# EAGLE design Placa ATMEL 2019 v2.4 (EAGLE 7.6.0)
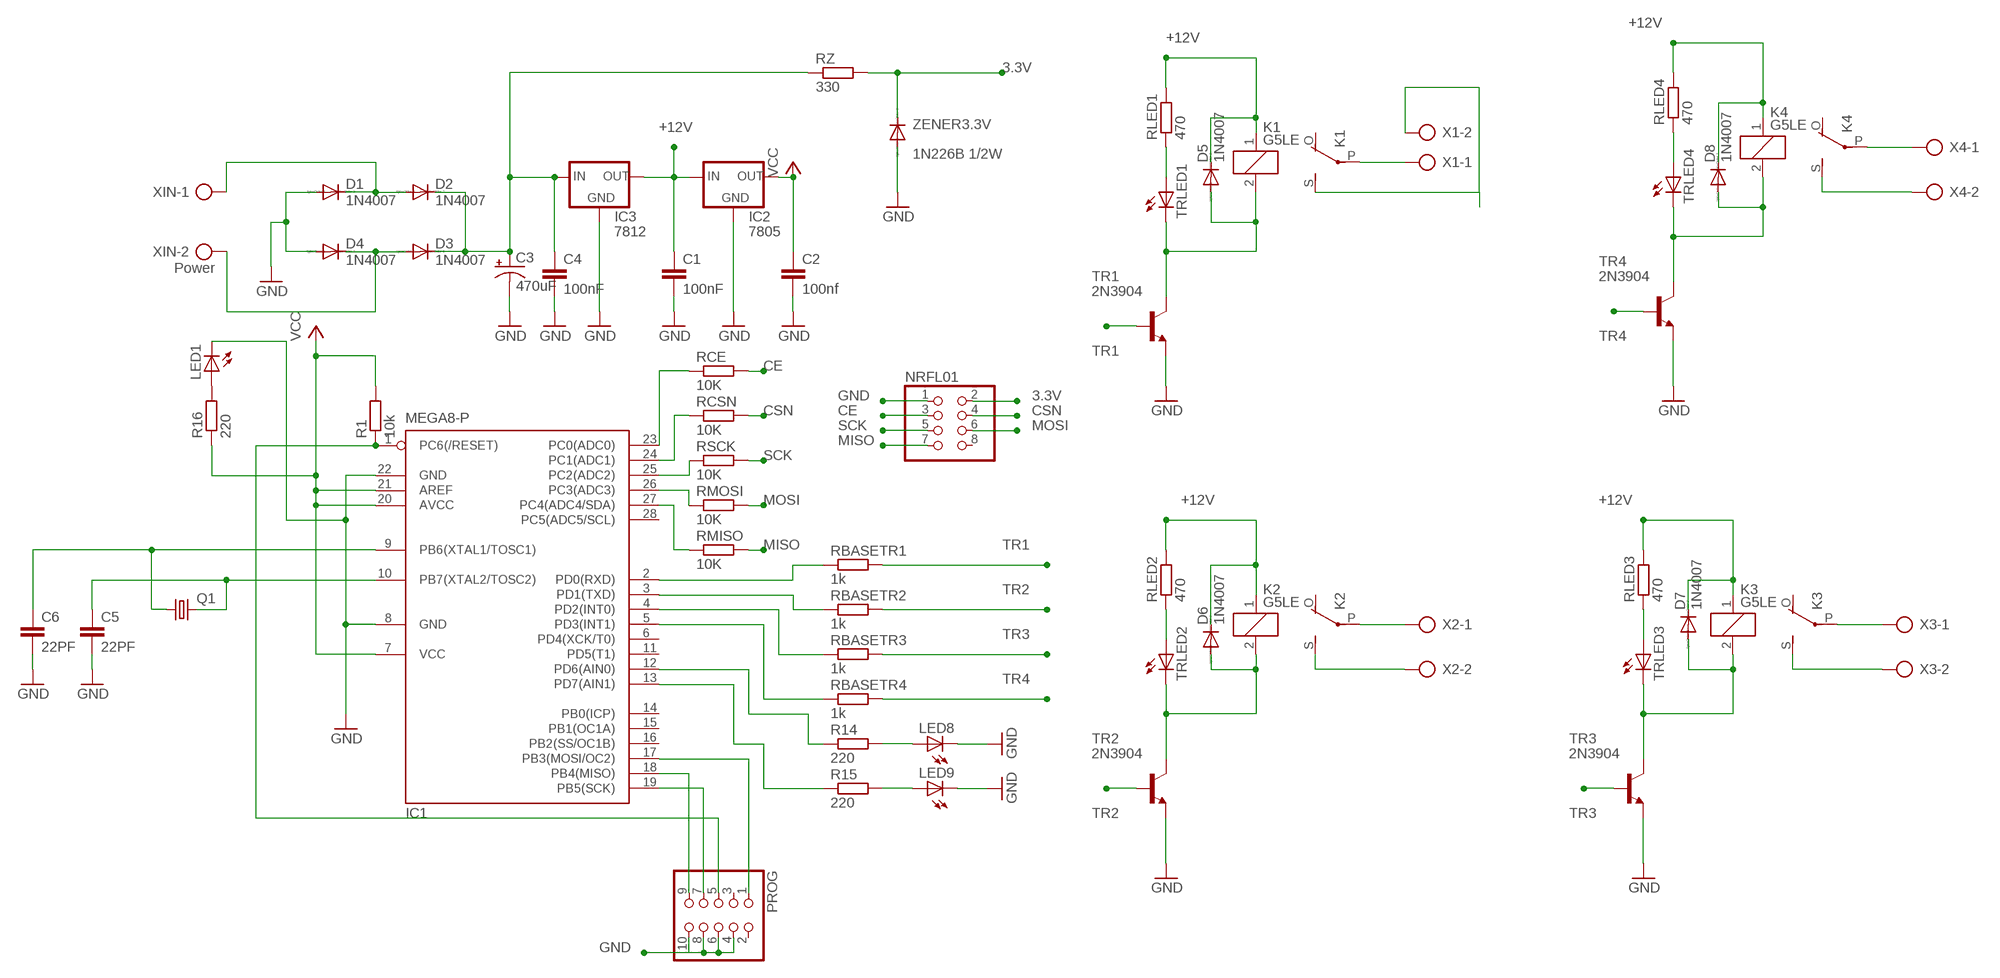
[diagram p0: schematic, sheet 1]

## Parts
C1  100nF  C-EU050-025X075  [C050-025X075]
C2  100nf  C-EU050-025X075  [C050-025X075]
C3  470uF  CPOL-USE7.5-16  [E7,5-16]
C4  100nF  C-EU050-025X075  [C050-025X075]
C5  22PF  C-EU050-024X044  [C050-024X044]
C6  22PF  C-EU050-024X044  [C050-024X044]
D1  1N4007  1N4004  [DO41-10]
D2  1N4007  1N4004  [DO41-10]
D3  1N4007  1N4004  [DO41-10]
D4  1N4007  1N4004  [DO41-10]
D5  1N4007  1N4004  [DO41-10]
D6  1N4007  1N4004  [DO41-10]
D7  1N4007  1N4004  [DO41-10]
D8  1N4007  1N4004  [DO41-10]
IC1  MEGA8-P  [DIL28-3]
IC2  7805  78XXL  [78XXL]
IC3  7812  78XXL  [78XXL]
K1  G5LE  [G5LE]
K2  G5LE  [G5LE]
K3  G5LE  [G5LE]
K4  G5LE  [G5LE]
LED1  LED5MM  [LED5MM]
LED8  LED5MM  [LED5MM]
LED9  LED5MM  [LED5MM]
NRFL01  PINHD-2X4  [2X04]
PROG  PINHD-2X5  [2X05]
Q1  CRYSTALHC49S  [HC49/S]
R1  10k  R-EU_0207/10  [0207/10]
R14  220  R-EU_0207/10  [0207/10]
R15  220  R-EU_0207/10  [0207/10]
R16  220  R-EU_0309/10  [0309/10]
RBASETR1  1k  R-EU_0207/10  [0207/10]
RBASETR2  1k  R-EU_0207/10  [0207/10]
RBASETR3  1k  R-EU_0204/7  [0204/7]
RBASETR4  1k  R-EU_0207/15  [0207/15]
RCE  10K  R-EU_0207/10  [0207/10]
RCSN  10K  R-EU_0207/10  [0207/10]
RLED1  470  R-EU_0207/10  [0207/10]
RLED2  470  R-EU_0207/10  [0207/10]
RLED3  470  R-EU_0207/10  [0207/10]
RLED4  470  R-EU_0207/10  [0207/10]
RMISO  10K  R-EU_0207/10  [0207/10]
RMOSI  10K  R-EU_0207/10  [0207/10]
RSCK  10K  R-EU_0207/10  [0207/10]
RZ  330  R-EU_0207/10  [0207/10]
TR1  2N3904  [TO92]
TR2  2N3904  [TO92]
TR3  2N3904  [TO92]
TR4  2N3904  [TO92]
TRLED1  LED5MM  [LED5MM]
TRLED2  LED5MM  [LED5MM]
TRLED3  LED5MM  [LED5MM]
TRLED4  LED5MM  [LED5MM]
X1  AK300/2  [AK300/2]
X2  AK300/2  [AK300/2]
X3  AK300/2  [AK300/2]
X4  AK300/2  [AK300/2]
XIN  Power  AK500/2  [AK500/2]
ZENER3.3V  1N226B 1/2W  1N4148DO35-10  [DO35-10]

## Nets
3.3V: NRFL01.2 RZ.2 ZENER3.3V.C
+12V: C1.1 D5.C D6.C D7.C D8.C IC2.IN IC3.OUT K1.1 K2.1 K3.1 K4.1 RLED1.2 RLED2.2 RLED3.2 RLED4.2
CE: NRFL01.3 RCE.2
CSN: NRFL01.4 RCSN.2
GND: C1.2 C2.2 C3.- C4.2 C5.2 C6.2 D1.A D4.A IC1.8(GND) IC1.22(GND) IC2.GND IC3.GND LED1.K(C) LED8.K(C) LED9.K(C) NRFL01.1 PROG.4 PROG.6 PROG.8 PROG.10 TR1.3(E) TR2.3(E) TR3.3(E) TR4.3(E) ZENER3.3V.A
MISO: NRFL01.7 RMISO.2
MOSI: NRFL01.6 RMOSI.2
N$1: IC1.1(PC6(/RESET)) PROG.5 R1.1
N$2: IC1.23(PC0(ADC0)) RCE.1
N$3: IC1.24(PC1(ADC1)) RCSN.1
N$4: IC1.25(PC2(ADC2)) RSCK.1
N$5: IC1.26(PC3(ADC3)) RMOSI.1
N$6: RLED1.1 TRLED1.A
N$7: IC1.2(PD0(RXD)) RBASETR1.1
N$8: IC1.3(PD1(TXD)) RBASETR2.1
N$10: IC1.4(PD2(INT0)) RBASETR3.1
N$12: IC1.5(PD3(INT1)) RBASETR4.1
N$13: IC1.12(PD6(AIN0)) R14.1
N$14: IC1.13(PD7(AIN1)) R15.1
N$15: IC1.27(PC4(ADC4/SDA)) RMISO.1
N$16: IC1.17(PB3(MOSI/OC2)) PROG.1
N$17: LED1.A R16.2
N$18: IC1.19(PB5(SCK)) PROG.7
N$19: IC1.18(PB4(MISO)) PROG.9
N$22: C3.+ C4.1 D2.C D3.C IC3.IN RZ.1
N$24: D1.C D2.A XIN.1
N$29: D5.A K1.2 TR1.1(C) TRLED1.K(C)
N$31: K1.S(2:S) X1.2
N$32: K1.P(2:P) X1.1
N$65: D3.A D4.C XIN.2
N$71: RLED2.1 TRLED2.A
N$81: D6.A K2.2 TR2.1(C) TRLED2.K(C)
N$83: K2.S(2:S) X2.2
N$84: K2.P(2:P) X2.1
N$85: RLED3.1 TRLED3.A
N$86: D7.A K3.2 TR3.1(C) TRLED3.K(C)
N$88: K3.S(2:S) X3.2
N$89: K3.P(2:P) X3.1
N$118: RLED4.1 TRLED4.A
N$135: C5.1 IC1.10(PB7(XTAL2/TOSC2)) Q1.2
N$136: C6.1 IC1.9(PB6(XTAL1/TOSC1)) Q1.1
N$138: D8.A K4.2 TR4.1(C) TRLED4.K(C)
N$147: K4.S(2:S) X4.2
N$148: K4.P(2:P) X4.1
N$152: LED8.A R14.2
N$153: LED9.A R15.2
SCK: NRFL01.5 RSCK.2
TR1: RBASETR1.2 TR1.2(B)
TR2: RBASETR2.2 TR2.2(B)
TR3: RBASETR3.2 TR3.2(B)
TR4: RBASETR4.2 TR4.2(B)
VCC: C2.1 IC1.7(VCC) IC1.20(AVCC) IC1.21(AREF) IC2.OUT R1.2 R16.1
Unconnected: IC1.6(PD4(XCK/T0)) IC1.11(PD5(T1)) IC1.14(PB0(ICP)) IC1.15(PB1(OC1A)) IC1.16(PB2(SS/OC1B)) IC1.28(PC5(ADC5/SCL)) K1.O(2:O) K2.O(2:O) K3.O(2:O) K4.O(2:O) NRFL01.8 PROG.2 PROG.3

## Library data of the parts
C1 C2 C4-C6 = rcl:C-EU: CAPACITOR, European symbol
C3 = rcl:CPOL-US: POLARIZED CAPACITOR, American symbol
D1-D8 = diode:1N4004: DIODE general purpose rectifier, 1 A
IC1 = atmel:MEGA8-P: MICROCONTROLLER 8 Kbytes FLASH, 1 kbytes SRAM, 512 bytes EEPROM, USART, 4-channel 10 bit ADC, 2-channel 8 bit ADC Pin compatible with Atmega48, ATMega88, ATMega168 Source: avr.lbr; OC_FARNELL: unknown; OC_NEWARK: unknown
IC2 IC3 = v-reg:78XXL: VOLTAGE REGULATOR
K1-K4 = relay:G5LE: RELAY 1 x switch, 10 A/120 V AC, 8 A/30 V DC, Omron; OC_FARNELL: unknown; OC_NEWARK: unknown
LED1 LED8 LED9 TRLED1-TRLED4 = led:LED: LED OSRAM: - CHIPLED LG R971, LG N971, LY N971, LG Q971, LY Q971, LO R971, LY R971 LH N974, LH R974 LS Q976, LO Q976, LY Q976 LO Q996 - Hyper CHIPLED LW Q18S LB Q993, LB Q99A, LB R99A - SideLED LS A670, LO A670, LY A670, LG A670, LP A670 LB A673, LV A673, LT A673, LW A673 LH A674 LY A675 LS A676, LA A676, LO A676, LY A676, LW A676 LS A679, LY A679, LG A679 - Hyper Micro SIDELED® LS Y876, LA Y876, LO Y876, LY Y876 LT Y87S - SmartLED LW L88C, LW L88S LB L89C, LB L89S, LG L890 LS L89K, LO L89K, LY L89K LS L896, LA L896, LO L896, LY L896 - TOPLED LS T670, LO T670, LY T670, LG T670, LP T670 LSG T670, LSP T670, LSY T670, LOP T670, LYG T670 LG T671, LOG T671, LSG T671 LB T673, LV T673, LT T673, LW T673 LH T674 LS T676, LA T676, LO T676, LY T676, LB T676, LH T676, LSB T676, LW T676 LB T67C, LV T67C, LT T67C, LS T67K, LO T67K, LY T67K, LW E67C LS E67B, LA E67B, LO E67B, LY E67B, LB E67C, LV E67C, LT E67C LW T67C LS T679, LY T679, LG T679 LS T770, LO T770, LY T770, LG T770, LP T770 LB T773, LV T773, LT T773, LW T773 LH T774 LS E675, LA E675, LY E675, LS T675 LS T776, LA T776, LO T776, LY T776, LB T776 LHGB T686 LT T68C, LB T68C - Hyper Mini TOPLED® LB M676 - Mini TOPLED Santana® LG M470 LS M47K, LO M47K, LY M47K Source: http://www.osram.convergy.de LUXEON: - LUMILED® LXK2-PW12-R00, LXK2-PW12-S00, LXK2-PW14-U00, LXK2-PW14-V00 LXK2-PM12-R00, LXK2-PM12-S00, LXK2-PM14-U00 LXK2-PE12-Q00, LXK2-PE12-R00, LXK2-PE12-S00, LXK2-PE14-T00, LXK2-PE14-U00 LXK2-PB12-K00, LXK2-PB12-L00, LXK2-PB12-M00, LXK2-PB14-N00, LXK2-PB14-P00, LXK2-PB14-Q00 LXK2-PR12-L00, LXK2-PR12-M00, LXK2-PR14-Q00, LXK2-PR14-R00 LXK2-PD12-Q00, LXK2-PD12-R00, LXK2-PD12-S00 LXK2-PH12-R00, LXK2-PH12-S00 LXK2-PL12-P00, LXK2-PL12-Q00, LXK2-PL12-R00 Source: www.luxeon.com KINGBRIGHT: KA-3528ASYC Source: www.kingbright.com
NRFL01 = pinhead:PINHD-2X4: PIN HEADER
PROG = pinhead:PINHD-2X5: PIN HEADER
Q1 = crystal:CRYSTAL: CRYSTAL; OC_FARNELL: 1667008; OC_NEWARK: unknown
R1 R14-R16 RBASETR1-RBASETR4 RCE RCSN RLED1-RLED4 RMISO RMOSI RSCK RZ = rcl:R-EU_: RESISTOR, European symbol
TR1-TR4 = transistor-npn:2N3904: NPN Transistor
X1-X4 = con-ptr500:AK300/2: CONNECTOR; OC_FARNELL: unknown; OC_NEWARK: unknown
XIN = con-ptr500:AK500/2: CONNECTOR; OC_FARNELL: unknown; OC_NEWARK: unknown
ZENER3.3V = diode:1N4148: DIODE high speed (Philips)

## Board
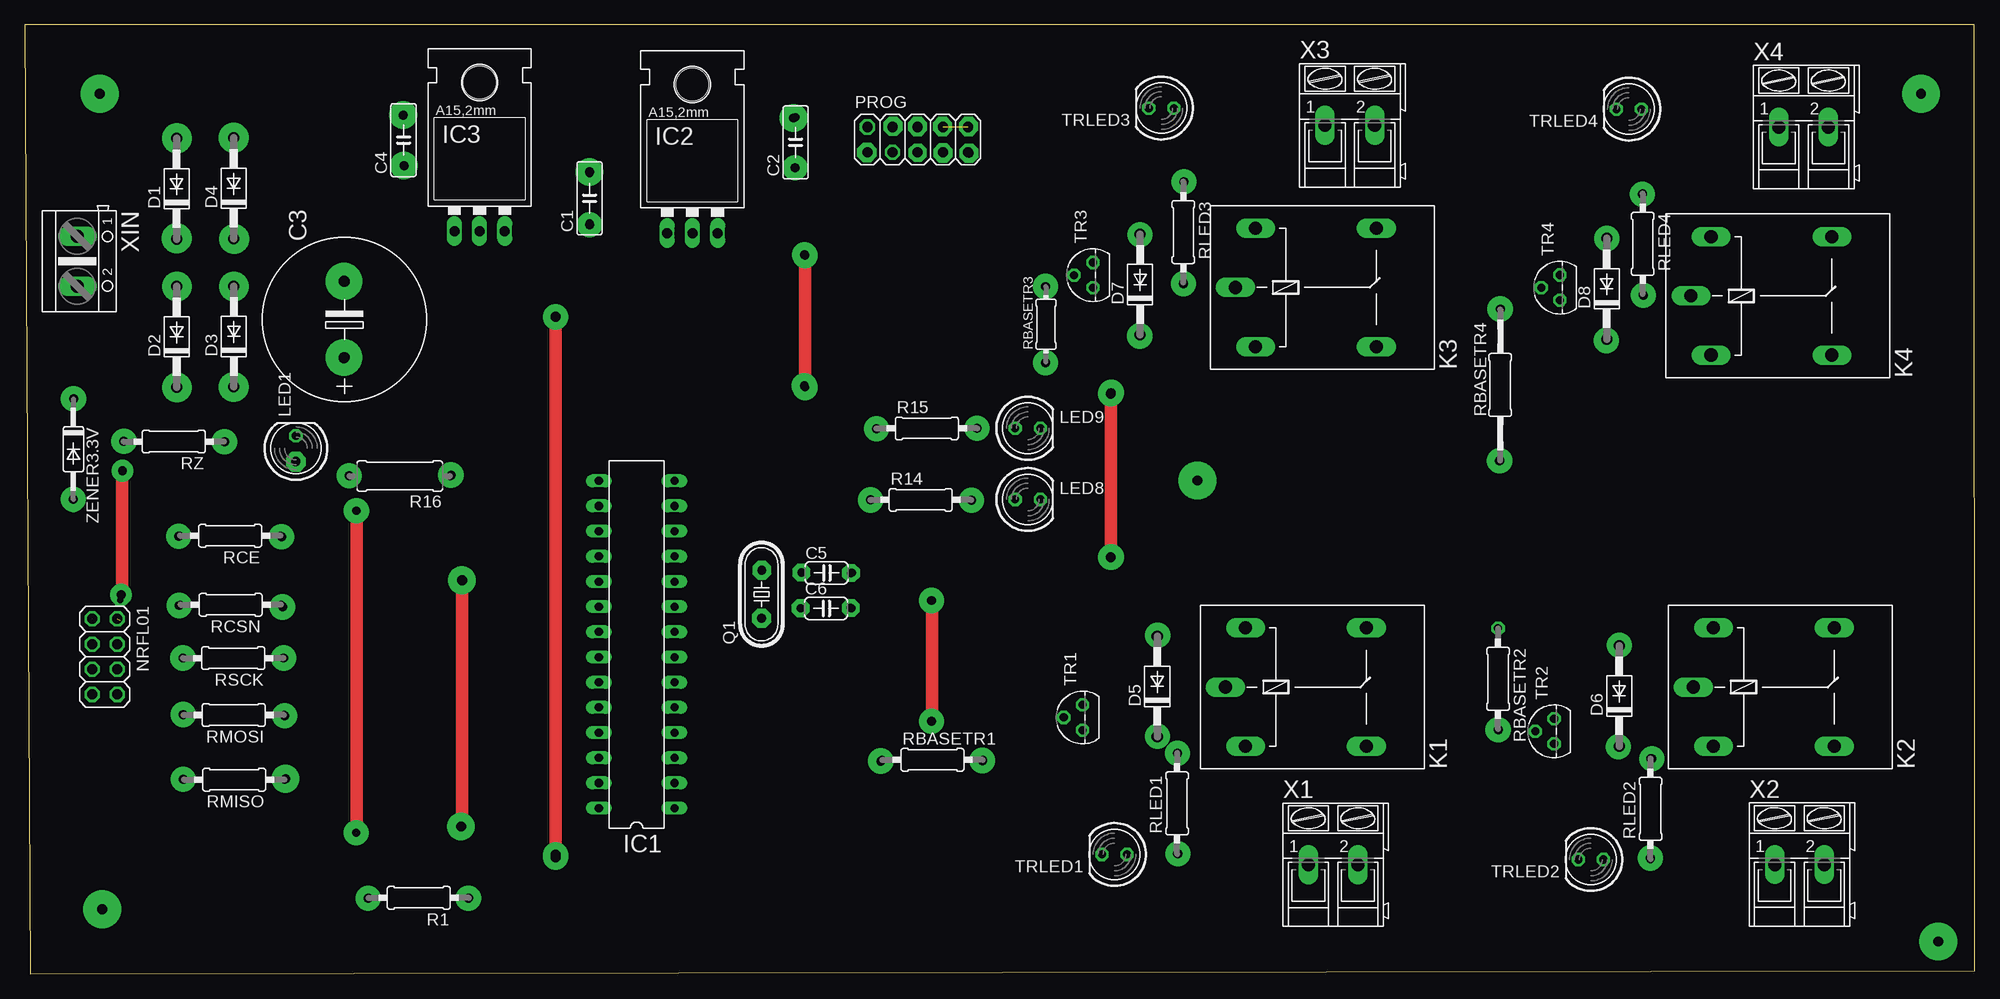
[diagram p1: board, top side]
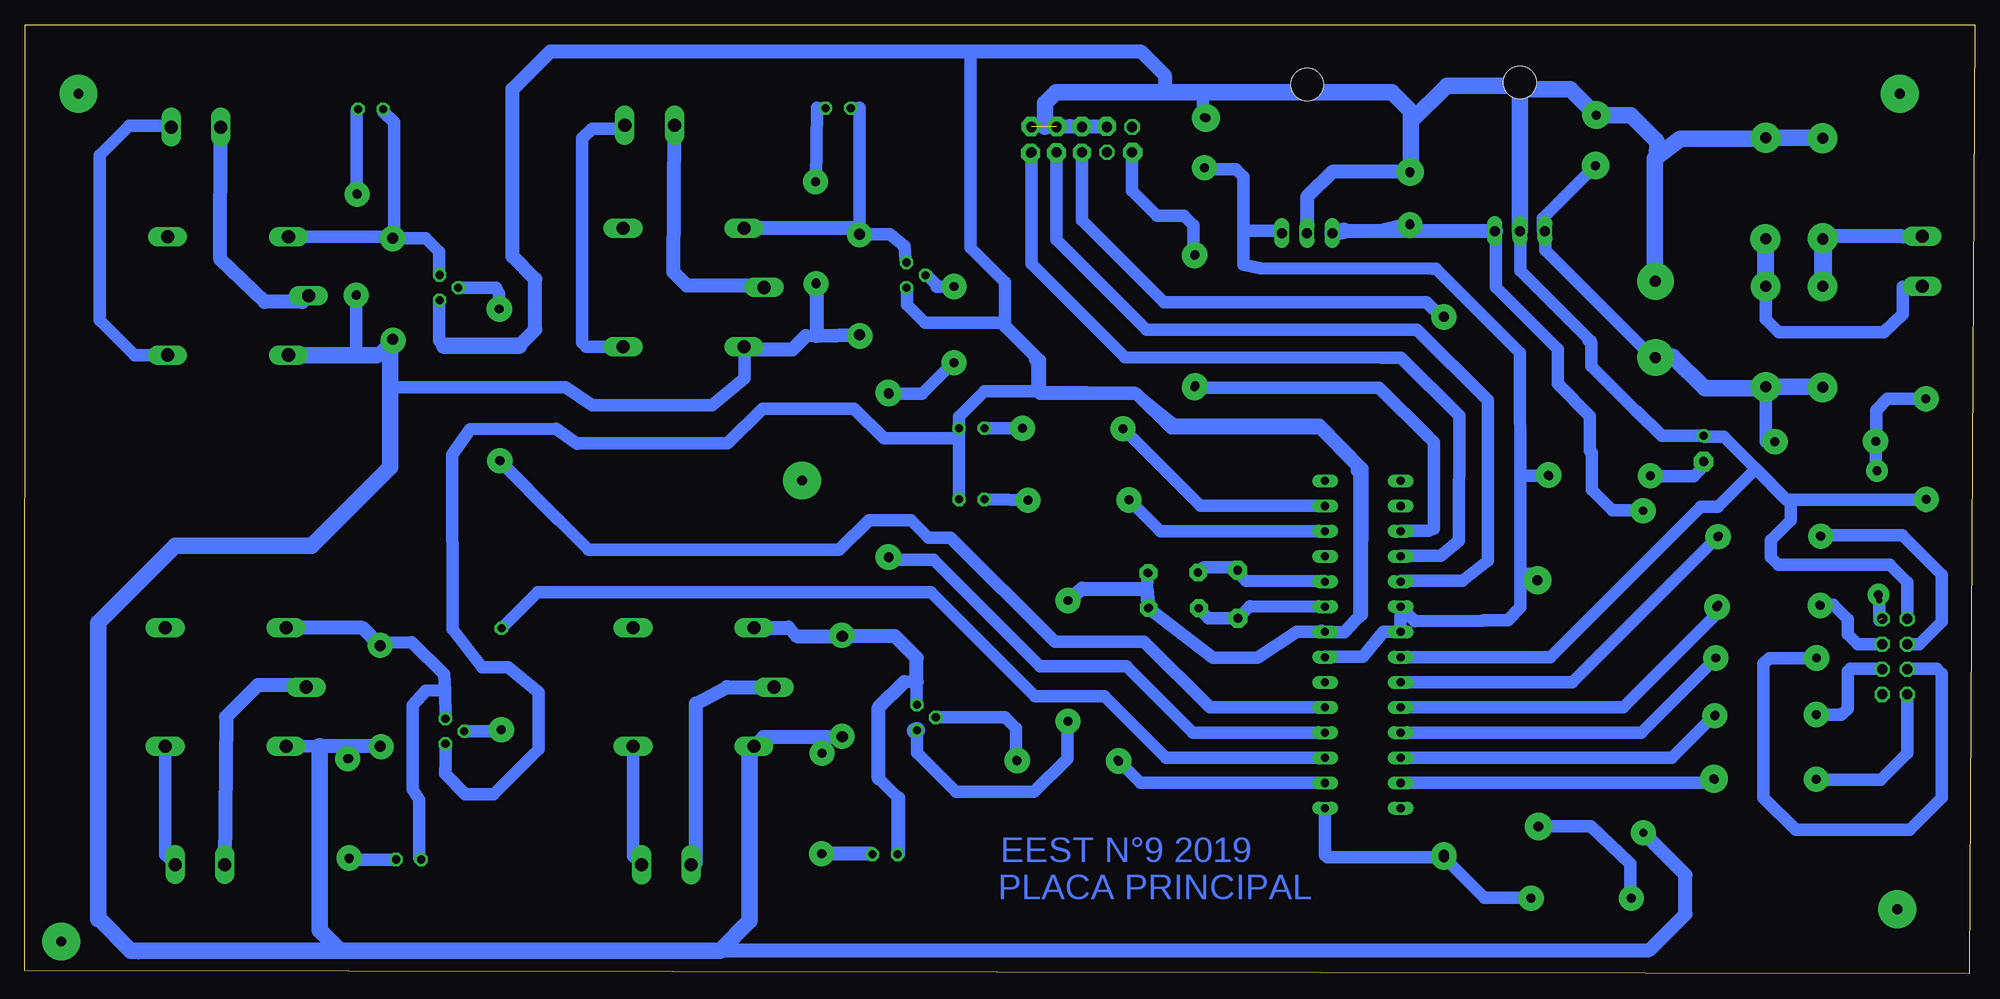
[diagram p2: board, bottom side, seen from below]

Size 196.74 x 95.72 mm. Coordinates in mm from the lower left corner, seen from the top.
Outline: 0.57,0 196.74,0.28 196.7,95.72 0,95.7 0.57,0
Copper layers (1*16): Top 0.035mm / dielectric 1.5mm / Bottom 0.035mm
Design rules "default *": minimum track width 10mil, minimum drill 1mm, track to track 1mm, track to pad 1mm, pad to pad 1mm, via to via 1mm, smd to smd 1mm, copper to edge 1mm, drill to drill 1mm, minimum pad ring 10mil, minimum via ring 8mil, stop-mask expansion 4mil, vias tented up to drill 0mil, thermal gap 10mil

### Footprints (pad centres in the part's own frame; a part is rotated, then mirrored left to right if it is on the bottom)
C050-025X075 = drill 0.813 octagon: 1 -2.54,0; 2 2.54,0
E7,5-16 = drill 1.016 pad 3.15: + -3.81,0 | drill 1.016 pad 3.15 octagon: - 3.81,0
C050-024X044 = drill 0.813 octagon: 1 -2.54,0; 2 2.54,0
DO41-10 = drill 1.118: A 5.08,0; C -5.08,0
DIL28-3 = drill 0.813 long: 1 -16.51,-3.81; 2 -13.97,-3.81; 3 -11.43,-3.81; 4 -8.89,-3.81; 5 -6.35,-3.81; 6 -3.81,-3.81; 7 -1.27,-3.81; 8 1.27,-3.81; 9 3.81,-3.81; 10 6.35,-3.81; 11 8.89,-3.81; 12 11.43,-3.81; 13 13.97,-3.81; 14 16.51,-3.81; 15 16.51,3.81; 16 13.97,3.81; 17 11.43,3.81; 18 8.89,3.81; 19 6.35,3.81; 20 3.81,3.81; 21 1.27,3.81; 22 -1.27,3.81; 23 -3.81,3.81; 24 -6.35,3.81; 25 -8.89,3.81; 26 -11.43,3.81; 27 -13.97,3.81; 28 -16.51,3.81
78XXL = drill 1.016 long: GND 0,-3.81; IN -2.54,-3.81; OUT 2.54,-3.81 | hole 3.302: 0,11.176
G5LE = drill 1.321 long: 1 -7.493,-5.969; 2 -7.493,5.969; O 4.699,5.969; P -9.525,0; S 4.699,-5.969
LED5MM = drill 0.813 octagon: A -1.27,0; K 1.27,0
2X04 = drill 1.016 octagon: 1 -3.81,-1.27; 2 -3.81,1.27; 3 -1.27,-1.27; 4 -1.27,1.27; 5 1.27,-1.27; 6 1.27,1.27; 7 3.81,-1.27; 8 3.81,1.27
2X05 = drill 1.016 octagon: 1 -5.08,-1.27; 2 -5.08,1.27; 3 -2.54,-1.27; 4 -2.54,1.27; 5 0,-1.27; 6 0,1.27; 7 2.54,-1.27; 8 2.54,1.27; 9 5.08,-1.27; 10 5.08,1.27
HC49/S = drill 0.813: 1 -2.413,0; 2 2.413,0
0207/10 = drill 0.813 octagon: 1 -5.08,0; 2 5.08,0
0309/10 = drill 0.813 octagon: 1 -5.08,0; 2 5.08,0
0204/7 = drill 0.813 octagon: 1 -3.81,0; 2 3.81,0
0207/15 = drill 0.813 octagon: 1 -7.62,0; 2 7.62,0
TO92 = drill 0.813 octagon: 1 1.27,0; 2 0,1.905; 3 -1.27,0
AK300/2 = drill 1.321 long: 1 -2.515,0; 2 2.489,0
AK500/2 = drill 1.321 long: 1 -2.515,0; 2 2.515,0
DO35-10 = drill 0.813 long: A 5.08,0; C -5.08,0

### Placement (x,y rotation side)
C1  56.98,78.22 90 top
C2  77.78,83.85 90 top
C3  32.25,66 90 top
C4  38.21,84.09 90 top
C5  80.9,40.43 0 top
C6  80.85,36.85 0 top
D1  15.32,79.19 90 top
D2  15.33,64.25 90 top
D3  21.09,64.28 90 top
D4  21.08,79.23 90 top
D5  114.26,28.98 90 top
D6  160.87,28.02 90 top
D7  112.53,69.52 90 top
D8  159.61,69.1 90 top
IC1  61.73,33.21 90 top
IC2  67.36,78.52 0 top
IC3  45.89,78.71 0 top
K1  130.67,28.92 0 top
K2  177.87,28.92 0 top
K3  131.67,69.22 0 top
K4  177.63,68.38 0 top
LED1  27.36,52.99 90 top
LED8  101.2,47.84 0 top
LED9  101.2,55.02 0 top
NRFL01  8.07,31.98 270 top
PROG  90.09,84.14 0 top
Q1  74.33,38.28 90 top
R1  39.75,7.66 180 top
R14  90.39,47.8 0 top
R15  91.01,55.01 0 top
R16  37.83,50.2 180 top
RBASETR1  91.58,21.58 0 top
RBASETR2  148.65,29.75 270 top
RBASETR3  103.03,65.51 90 top
RBASETR4  148.86,59.39 90 top
RCE  20.72,44.18 180 top
RCSN  20.77,37.22 180 top
RLED1  116.26,17.18 90 top
RLED2  164.03,16.63 90 top
RLED3  116.89,74.81 270 top
RLED4  163.24,73.62 270 top
RMISO  21.13,19.57 180 top
RMOSI  21.08,26.1 180 top
RSCK  21.03,31.84 180 top
RZ  15.03,53.68 180 top
TR1  106.73,25.85 90 top
TR2  154.3,24.45 90 top
TR3  107.78,70.47 90 top
TR4  154.9,69.21 90 top
TRLED1  109.95,12.03 180 top
TRLED2  158.01,11.52 180 top
TRLED3  114.67,87.32 180 top
TRLED4  161.85,87.22 180 top
X1  132.02,10.99 0 top
X2  179.07,11 0 top
X3  133.71,85.58 0 top
X4  179.49,85.4 0 top
XIN  5.3,71.87 270 top
ZENER3.3V  4.91,52.91 270 top

### Tracks (layer width: path | path; a pad name or v marks a point on that pad's centre or on a via)
3.3V  (via drill 0.6, 0.9 pad 2.54)  (1 unrouted)
  Top 1.27: v9.62,37.66 9.85,38.03 v9.85,50.7
  Bottom 1.27: 9.62,35.65 v9.62,37.66 | v9.85,50.7 10.03,50.7 RZ.2 9.95,56.84 8.8,57.99 v4.92,57.99 ZENER3.3V.C
+12V  (via drill 0.8 pad 2.54)  (1 unrouted)
  Top 1.27: v33.47,46.69 33.47,14.26 33.41,14.2
  Bottom 0.305: 126.96,2.05 126.63,2.38
  Bottom 0.406: D7.C 115.44,64.44 115.44,64.12 117.01,64.12 117.01,64.54 117.84,64.54 119.43,62.95 124.17,62.95 124.26,63.04 124.26,60.28 124.16,60.18 124.55,60.18 127.46,57.27 139.29,57.27 139.49,57.47 140.47,57.47 142.1,59.1 159.88,59.1 160.09,58.89 160.09,50.79 167.76,43.12 181.72,42.87 181.58,43.01 181.94,42.76 189.21,35.24 189.46,8.85 189.35,5.49 188.85,5.23 185.27,1.65 127.06,2.15 126.96,2.05
  Bottom 1.27: C1.1 60.12,74.93 63.66,74.93 | 123.9,62.97 K3.1 124.12,63.19 124.12,60.08 127.41,57.35 139.5,57.35 142.17,59.18 159.88,59.18 | 117.94,64.32 116.86,64.34 | K1.1 122.23,23.9 | RLED3.2 116.86,68.63 | 161.22,62.41 D8.C 159.88,63.75 | RLED4.2 163.28,68.5 163.28,62.41 | RLED1.2 116.23,22.29 116.23,23.9 | D6.C 160.88,22.95 | 166.99,22.95 K2.1 | RLED2.2 164.22,21.9 164.22,22.95 | v33.47,46.69 34.28,46.75 36.56,46.75 38.62,48.81 38.62,52.55 38.82,52.75 38.82,56.25 42.07,59.5 42.07,63 48.32,69.25 48.32,74.18 49.07,74.93
  Bottom 1.422: 63.66,74.93 49.07,74.93 48.43,74.93 | 123.9,62.97 119.29,62.97 117.94,64.32 | D7.C 116.86,64.34 116.86,68.63 | 122.23,23.9 116.23,23.9 D5.C | 160.88,22.95 164.22,22.95 166.99,22.95 | K1.1 123.62,22.51 | 126.63,2.38 32.83,2.38 29.19,6.02 29.19,9.98 33.41,14.2
  Bottom 1.676: IC2.IN 63.66,74.93 | 48.43,74.93 IC3.OUT | 161.22,62.41 163.28,62.41 K4.1 | 123.62,22.51 123.62,5.32 126.61,2.33 164.92,2.33 | 164.92,2.33 166.99,4.4 166.99,22.95 | 159.88,63.75 159.88,59.18 159.88,51.08 167.79,43.17 181.56,43.17 189.35,35.38 189.35,5.64 | 189.35,5.49 189.35,5.64 | 189.35,5.64 186.04,2.33 164.92,2.33
CE
  Bottom 1.27: NRFL01.3 5.57,33.25 3.32,35.5 3.32,40.25 7.32,44.25 15.57,44.25 RCE.2
CSN
  Bottom 1.27: RCSN.2 14.29,37.22 12.82,35.75 12.82,34.25 11.82,33.25 NRFL01.4
GND  (via drill 0.6)  (3 unrouted)
  Top 1.27: v91.54,25.48 v91.54,37.64
  Bottom 1.27: 61.85,36.38 63.6,34.43 65.79,34.44 65.84,34.58 IC1.8 68.39,34.49 72.35,31.88 76.86,31.88 C6.2 | 61.85,36.38 63.15,34.94 | 61.85,36.38 61.8,50.93 66.13,55.36 76.41,55.37 80.72,55.37 84.79,58.6 94.18,58.69 94.32,58.83 | 102.47,54 LED8.K 102.43,47.88 | 102.47,54 LED9.K 102.47,56.19 99.92,58.74 94.41,58.74 94.32,58.83 | C2.2 77.88,86.49 77.88,88.64 78.16,88.92 | 56.87,80.87 C1.2 57.11,80.89 | 46.32,89.23 45.89,88.8 | TR3.3 107.66,69.08 107.74,69 107.74,67.5 105.89,65.65 98.09,65.65 94.32,61.88 94.32,58.83 | C5.2 83.39,40.38 83.59,38.84 | TR4.3 154.95,67.89 154.95,63.87 154.43,63.35 | TR1.3 106.74,22.3 102.78,18.34 94.89,18.34 91.54,21.69 v91.54,25.48 | TR2.3 154.28,23.18 154.28,20.67 154.32,20.63 154.32,20.15 152.29,18.12 149.44,18.12 144.92,22.64 144.92,28.37 147.96,30.89 150.58,30.89 153.55,34.73 153.61,52.34 151.8,54.92 143.13,54.95 141,53.44 140.94,53.5 125.82,53.5 122.32,57 113.07,57 110.07,54 102.47,54 | IC3.GND 45.85,74.86 45.85,70.9 38.73,63.78 38.98,63.92 38.67,63.61 38.67,61.3 34.13,56.76 34.07,56.76 31.57,54.26 LED1.K 27.25,54.15 25.32,54.15 22.1,50.93 | 22.1,50.93 19,47.83 ZENER3.3V.A 18.24,47.83 18.57,47.5 18.57,45.75 20.57,43.75 20.57,42 19.82,41.25 8.57,41.25 6.82,39.5 6.82,35.81 | IC1.22 42.81,31.94 27.64,47.11 25.92,47.11 22.1,50.93 | 61.85,36.38 61.85,36.22 62.07,36 62.07,50.5 62.32,50.75 62.32,51.25 66.07,55 81.07,55 84.57,58.5 94.32,58.5 94.57,58.75 94.57,61.75 94.82,62 94.82,62.25 97.82,65.25 97.82,69.75 101.32,73.25 101.32,92.8 101.57,93.05 | PROG.10 95.27,85.31
  Bottom 1.422: 32.12,84.02 32.26,82.24 | 45.93,74.54 IC3.GND | 46.68,89.59 46.32,89.23 | 57.11,80.89 64.83,80.89 67.36,78.36 IC2.GND | C6.2 83.59,38.84 90.06,38.84 v91.54,37.64 | 81.72,88.92 81.72,90.64 84.13,93.05 101.57,93.05 143.7,93.05 147.52,89.23 147.52,72.35 145.24,70.07 145.24,64.96 146.85,63.35 | PROG.4 PROG.6 PROG.8
  Bottom 1.676: D1.A 15.36,84.31 D4.A 21.18,84.21 29.71,84.21 32.26,82.24 C3.- | 32.12,84.02 34.72,86.58 38.03,86.58 C4.2 40.81,89.23 46.32,89.23 | 93.8,85.41 93.8,87.81 92.69,88.92 81.72,88.92 78.16,88.92 58.79,88.92 56.87,87 56.87,86 | 56.87,80.87 56.87,86 | 56.87,86 53.28,89.59 46.68,89.59 | 45.89,88.8 IC3.GND | 154.43,63.35 146.85,63.35 | TR1.3 106.79,24.52 106.9,24.52
MISO
  Bottom 1.27: RMISO.2 9.5,19.57 6.82,22.25 6.82,28.15 NRFL01.7
MOSI
  Bottom 1.27: RMOSI.2 13.47,26.1 12.82,26.75 12.82,30.5 12.57,30.75 9.38,30.75 NRFL01.6
N$1  (via drill 1 pad 2.54)
  Top 1.27: v53.57,11.75 v53.57,12 v53.57,66.25
  Bottom 1.27: 65.07,11.75 65.32,11.75 65.54,11.97 IC1.1 65.54,12.22 65.07,11.75 | 53.82,11.75 v53.57,11.75 49.48,7.66 R1.1 | v53.57,66.25 53.82,66.25 55.32,67.75 81.82,67.75 90.07,76 90.07,82.85 PROG.5 | 65.07,11.75 53.82,11.75 | 53.82,11.75 v53.57,12
N$2
  Bottom 1.27: IC1.23 40.58,29.4 RCE.1
N$3
  Bottom 1.27: IC1.24 35.46,26.86 25.57,36.75 25.57,36.94 RCSN.1
N$4
  Bottom 1.27: IC1.25 33.63,24.32 RSCK.1
N$5
  Bottom 1.27: IC1.26 30.54,21.78 26.57,25.75 26.51,25.75 RMOSI.1
N$6
  Bottom 1.27: TRLED1.A 111.29,12.1
  Bottom 1.422: 111.29,12.1 RLED1.1
N$7
  Bottom 1.27: IC1.2 84.16,19.24 RBASETR1.1
N$8
  Bottom 1.27: IC1.3 81.6,21.78 87.82,28 94.82,28 105.32,38.5 144.98,38.5 RBASETR2.1
N$10  (via drill 1 pad 2.54)
  Top 1.27: v109.57,42 v109.57,58.5
  Bottom 1.27: IC1.4 78.89,24.32 85.57,31 94.32,31 105.07,41.75 109.32,41.75 v109.57,42 | v109.57,58.5 106.23,58.5 RBASETR3.1
N$12
  Bottom 1.27: IC1.5 77.18,26.86 83.82,33.5 92.82,33.5 103.32,44 105.57,44 107.32,45.75 111.57,45.75 114.57,42.75 139.84,42.75 142.84,45.75 142.95,45.87 RBASETR4.1
N$13
  Bottom 1.27: IC1.12 82.15,44.64 R14.1
N$14
  Bottom 1.27: IC1.13 78.1,47.18 R15.1
N$15
  Bottom 1.27: IC1.27 26.54,19.24 RMISO.1
N$16  (via drill 0.8 pad 2.54)
  Top 1.27: v78.73,72.44 v78.73,59.13
  Bottom 1.27: PROG.1 85.01,78.96 82.52,76.47 79.8,76.47 78.85,75.52 78.85,72.56 v78.73,72.44 | v78.73,59.13 60.1,59.13 55.12,54.15 54.77,53.8 54.58,53.61 54.58,44.9 55.05,44.68 57.88,44.68 IC1.17
N$17
  Bottom 1.27: LED1.A 27.36,51.14 28.33,50.17 32.72,50.17 R16.2
N$18
  Bottom 1.27: IC1.19 57.84,39.64 51.68,39.64 49.14,41.66 49.12,57.84 56.26,64.98 83.57,64.98 92.63,74.04 PROG.7
N$19
  Bottom 1.27: IC1.18 57.84,42.18 53.85,42.18 52.03,43.65 52.02,56.28 57.89,62.15 59.86,62.15 85.76,62.19 95.17,71.6 PROG.9
N$22
  Bottom 1.27: RZ.1 21.09,53.68 D3.C | C3.+ 32.51,62.19 43.32,73 43.32,74.87 IC3.IN 43.47,74.9 43.57,75 43.57,76.19 C4.1
  Bottom 1.676: D2.C 15.36,59.2 D3.C 21.24,59.05 27.22,59.05 30.47,62.24 C3.+
N$23  (via drill 0.9 pad 2)
  other vias: 27.35,51.64
N$24
  Bottom 1.27: XIN.1 7.24,74.38 | 14.99,74.11 D1.C
  Bottom 1.422: 7.24,74.38 15.32,74.38 D1.C
  Bottom 1.8: D1.C D2.A
N$28  (via drill 0.9 pad 2.18)
  other vias: 9.86,50.74
N$29
  Bottom 1.27: K1.2 123.16,34.91 | 119.7,34.91 118.85,34.06 | TR1.1 106.76,27.15 106.76,29.44 108,29.44 | TRLED1.K 108.59,12.12 | 108.59,17.72 110.58,19.71
  Bottom 1.422: 123.16,34.91 119.7,34.91 | 118.85,34.06 D5.A 108.95,34.06 106.76,31.87 106.76,29.44 | 108.59,12.12 108.59,17.72 | 110.58,19.71 110.58,26.86 108,29.44
N$30  (via drill 0.9 pad 2.54)
  other vias: 77.72,81.3
N$31
  Bottom 1.27: X1.2 135.37,11.85 K1.S
N$32
  Bottom 1.422: X1.1 129.01,11.14 129.01,27.25 125.9,28.92 K1.P
N$33  (via drill 0.9 pad 2.18)
  other vias: 9.71,38.23
N$34  (via drill 0.9 pad 2.54)
  other vias: 109.61,58.63
N$36  (via drill 0.9 pad 2.54)
  other vias: 109.61,42.03
N$38  (via drill 1 pad 3.81)
  other vias: 118.32,49.75
N$41  (via drill 1 pad 3.81)
  other vias: 7.57,88.75
N$43  (via drill 0.9 pad 1.93)
  other vias: 92.59,85.46
N$44  (via drill 0.9 pad 2.54)
  other vias: 96.61,21.5
N$46  (via drill 0.9 pad 2.54)
  other vias: 34.64,7.61
N$47  (via drill 0.9 pad 2.54)
  other vias: 44.76,7.6
N$49  (via drill 0.9 pad 2.54)
  other vias: 15.52,44.13
N$50  (via drill 0.9 pad 2.54)
  other vias: 15.59,37.14
N$51  (via drill 0.9 pad 2.54)
  other vias: 26,37
N$52  (via drill 0.9 pad 2.54)
  other vias: 78.65,59.3
N$55  (via drill 0.9 pad 1.93)
  other vias: 95.25,82.77
N$56  (via drill 0.9 pad 1.93)
  other vias: 84.96,82.84
N$59  (via drill 0.9 pad 1.93)
  other vias: 92.65,82.79
N$60  (via drill 0.9 pad 1.93)
  other vias: 90.09,85.46
N$61  (via drill 0.9 pad 1.93)
  other vias: 95.22,85.46
N$63  (via drill 0.9 pad 2.54)
  other vias: 86.37,21.45
N$64  (via drill 0.9 pad 1.85)
  other vias: 90.08,82.81
N$65
  Bottom 1.27: XIN.2 7.28,69.3 7.28,66.53 9.19,64.71 19.78,64.71 21.09,66.02 D3.A
  Bottom 1.7: D3.A D4.C
N$66  (via drill 0.9 pad 2.54)
  other vias: 78.68,72.53
N$69  (via drill 0.9 pad 2.8)
  other vias: 26.31,19.67
N$70  (via drill 0.9 pad 2.54)
  other vias: 25.9,44.08
N$71
  Bottom 1.27: RLED2.1 164,11.52 TRLED2.A
N$73  (via drill 0.9 pad 2.54)
  other vias: 15.96,31.85
N$74  (via drill 0.9 pad 2.54)
  other vias: 26.11,31.85
N$75  (via drill 0.9 pad 2.54)
  other vias: 26.23,26.01
N$76  (via drill 0.9 pad 2.54)
  other vias: 16,26.15
N$77  (via drill 0.9 pad 2.54)
  other vias: 15.99,19.62
N$78  (via drill 0.9 pad 2.54)
  other vias: 148.8,51.73
N$79  (via drill 0.9 pad 2.54)
  other vias: 116.97,79.9
N$81
  Bottom 1.27: D6.A 160.57,33.4 157.71,33.45 154.43,30.22 154.35,28.57 | 154.35,28.57 TR2.1 | TRLED2.K 156.94,11.72 156.94,17.53 157.62,18.61 157.62,27.06 156.31,28.55 154.35,28.57
  Bottom 1.422: D6.A 162.66,34.89 K2.2
N$83
  Bottom 1.27: X2.2 182.57,12.01 K2.S
N$84
  Bottom 1.27: K2.P 168.53,29.11
  Bottom 1.422: 168.53,29.11 173.23,29.11 176.44,25.91 X2.1
N$85
  Bottom 1.27: TRLED3.A 116.78,87.35 RLED3.1
N$86
  Bottom 1.27: TRLED3.K 112.53,87.36 D7.A | TR3.1 107.89,72.02 107.96,73.39 109.44,74.6 D7.A | D7.A 113.12,75.19
  Bottom 1.422: 113.12,75.19 K3.2
N$87  (via drill 0.9 pad 2.54)
  other vias: 116.91,69.61
N$88
  Bottom 1.27: X3.2 136.53,85.25 139.49,85.25 140.49,84.25 140.49,63.65 140.09,63.25 K3.S
N$89
  Bottom 1.27: K3.P 122.34,69.42
  Bottom 1.422: 122.34,69.42 129.94,69.42 131.28,70.77 X3.1
N$90  (via drill 0.9 pad 2.54)
  other vias: 112.53,74.55
N$91  (via drill 0.9 pad 2.54)
  other vias: 112.49,64.33
N$93  (via drill 0.9 pad 2.54)
  other vias: 102.99,69.32
N$96  (via drill 1 pad 2.8)
  other vias: 44.11,39.69
N$98
  Top 0.813: 78.87,72.57 78.6,72.38 78.64,59.93
N$101  (via drill 1 pad 3)
  other vias: 15.35,84.28
N$102  (via drill 1 pad 3)
  other vias: 21.09,84.33
N$103  (via drill 1 pad 3)
  other vias: 21.12,74.12
N$104  (via drill 1 pad 3)
  other vias: 15.32,74.18
N$105  (via drill 1 pad 3)
  other vias: 21.1,69.31
N$106  (via drill 1 pad 3)
  other vias: 15.35,69.31
N$107  (via drill 1 pad 3)
  other vias: 21.07,59.19
N$108  (via drill 1 pad 3)
  other vias: 15.35,59.12
N$116  (via drill 1 pad 2.8)
  other vias: 44.01,14.85
N$118
  Bottom 1.27: TRLED4.A 163.24,87.1 RLED4.1
N$124  (via drill 0.9 pad 2.8)
  other vias: 38.18,86.61
N$125  (via drill 0.9 pad 2.8)
  other vias: 38.26,81.52
N$126  (via drill 0.9 pad 2.8)
  other vias: 56.97,80.88
N$127  (via drill 0.9 pad 2.8)
  other vias: 77.56,86.32
N$128  (via drill 0.9 pad 2.54)
  other vias: 102.99,61.62
N$130
  Bottom 1.422: 91.3,85.5 91.33,85.53
N$131  (via drill 0.9 pad 1.93)
  other vias: 87.59,85.49
N$132  (via drill 1.1 pad 3.7)
  other vias: 32.2,62.15
N$133  (via drill 1.1 pad 3.7)
  other vias: 32.21,69.85
N$134
  Bottom 1.422: 95.15,85.62 95.18,85.62
N$135
  Bottom 1.27: IC1.10 65.58,39.6 73.51,39.64 74.33,40.46 Q1.2 74.66,41.02 77.75,41.02 78.34,40.43 C5.1
N$136
  Bottom 1.27: C6.1 77.33,35.87 Q1.1 73.14,37.06 IC1.9
N$137  (via drill 0.8 pad 1.78)
  other vias: 78.27,36.86
N$138
  Bottom 1.27: 170,74.49 K4.2 159.78,74.35 D8.A | D8.A 159.48,74.31 159.48,85.87 160.58,86.97 TRLED4.K | TR4.1 154.95,70.53 154.95,72.82 156.31,74.18 D8.A
N$139  (via drill 0.9 pad 2.54)
  other vias: 43,50.3
N$140  (via drill 0.9 pad 2.54)
  other vias: 32.73,50.23
N$141  (via drill 0.8 pad 1.78)
  other vias: 78.36,40.48
N$142  (via drill 0.8 pad 1.78)
  other vias: 83.36,40.41
N$143  (via drill 0.8 pad 1.78)
  other vias: 83.33,36.9
N$144  (via drill 0.9 pad 2.54)
  other vias: 96.06,55.02
N$145  (via drill 0.9 pad 1.9)
  other vias: 74.36,40.69
N$146  (via drill 0.9 pad 1.9)
  other vias: 74.34,35.86
N$147
  Bottom 1.27: X4.2 182.12,85.54 186.2,85.54 189.2,82.54 189.2,65.94 185.67,62.41 K4.S
N$148
  Bottom 1.27: K4.P 168.72,67.77
  Bottom 1.422: 168.72,67.77 172.54,67.77 177.01,72.05 X4.1
N$150  (via drill 0.9 pad 2.54)
  other vias: 57,75.54
N$151  (via drill 0.9 pad 2.54)
  other vias: 85.95,54.98
N$152
  Bottom 1.27: R14.2 94.92,47.77 LED8.A
N$153
  Bottom 1.27: R15.2 97.48,55.02 LED9.A
N$154  (via drill 0.9 pad 2.54)
  other vias: 85.32,47.79
N$155  (via drill 0.9 pad 2.54)
  other vias: 95.51,47.77
N$156  (via drill 0.9 pad 2.54)
  other vias: 116.34,12.1
N$157  (via drill 0.9 pad 2.54)
  other vias: 116.29,22.24
N$158  (via drill 0.9 pad 2.54)
  other vias: 114.27,23.95
N$159  (via drill 0.9 pad 2.54)
  other vias: 114.3,34.13
N$160  (via drill 0.9 pad 2.54)
  other vias: 160.89,33.14
N$161  (via drill 0.9 pad 2.54)
  other vias: 160.77,22.91
N$162  (via drill 0.9 pad 2.54)
  other vias: 164.15,21.67
N$163  (via drill 0.9 pad 2.54)
  other vias: 164,11.67
N$164  (via drill 0.9 pad 2.54)
  other vias: 159.61,74.16
N$165  (via drill 0.9 pad 2.54)
  other vias: 159.56,63.87
N$166  (via drill 0.9 pad 2.54)
  other vias: 163.32,68.43
N$167  (via drill 0.9 pad 2.54)
  other vias: 163.21,78.61
N$168  (via drill 0.9 pad 2.54)
  other vias: 148.66,24.62
N$169  (via drill 0.9 pad 2.54)
  other vias: 91.49,25.46
N$170  (via drill 0.9 pad 2.54)
  other vias: 91.48,37.65
N$171  (via drill 0.9 pad 2.54)
  other vias: 10,53.71
N$172  (via drill 0.9 pad 2.54)
  other vias: 20.15,53.67
N$173  (via drill 0.9 pad 2.54)
  other vias: 4.89,47.87
N$174  (via drill 1 pad 3.81)
  other vias: 7.82,6.5
N$175  (via drill 0.8 pad 2.54)
  other vias: 33.44,14.22
N$176  (via drill 0.8 pad 2.54)
  other vias: 33.44,46.7
N$177  (via drill 1 pad 3.81)
  other vias: 193.07,3.25
N$178  (via drill 1 pad 3.81)
  other vias: 191.32,88.75
SCK
  Bottom 1.27: RSCK.2 20.73,31.84 21.32,31.25 21.32,17.75 18.07,14.5 6.57,14.5 3.32,17.75 3.32,30.25 3.82,30.75 6.76,30.75 NRFL01.5
TR1
  Bottom 1.27: TR1.2 97.83,25.85 96.75,24.77 96.75,22.17 RBASETR1.2
TR2
  Bottom 1.27: RBASETR2.2 148.87,24.45 TR2.2
TR3
  Bottom 1.27: RBASETR3.2 104.57,69.32 | 104.57,69.32 104.72,69.32 | TR3.2 105.72,70.47 104.57,69.32
TR4  (via drill 0.9 pad 2.54)  (1 unrouted)
  Bottom 1.27: v148.86,67.05 148.86,68.55 149.19,69.21 TR4.2
VCC  (via drill 0.6)
  Top 1.27: v43.99,14.88 44.12,15.01 v44.12,39.72
  Bottom 1.27: 45.84,48.12 45.88,62.62 54.38,71.12 54.73,71.12 72.09,71.14 73.78,71.53 73.78,74.92 | IC1.7 65.51,31.97 61.73,31.97 59.64,34.48 IC1.21 57.97,35.4 IC1.20 56.47,35.57 49.71,35.58 49.5,35.67 47.12,35.67 45.84,36.95 45.84,40.33 | 45.84,40.33 45.84,48.12 | R1.2 34.73,7.37 34.73,11.09 38.74,14.88 v43.99,14.88 | v44.12,39.72 44.73,40.33 45.84,40.33 | 73.78,74.92 73.78,80.39 74.53,81.14 77.61,81.14 C2.1 77.84,81.25 78.1,81.4 77.72,81.51 | IC2.OUT 70.11,74.92 73.78,74.92 | 45.84,48.12 45.84,49.98 45.57,50.25 42.96,50.25 R16.1

### Text on the board
Bottom: EEST N°9 2019 | PLACA PRINCIPAL